# EAGLE schematic tapecleaner (EAGLE 7.2.0)

## Sheet 1 of 2
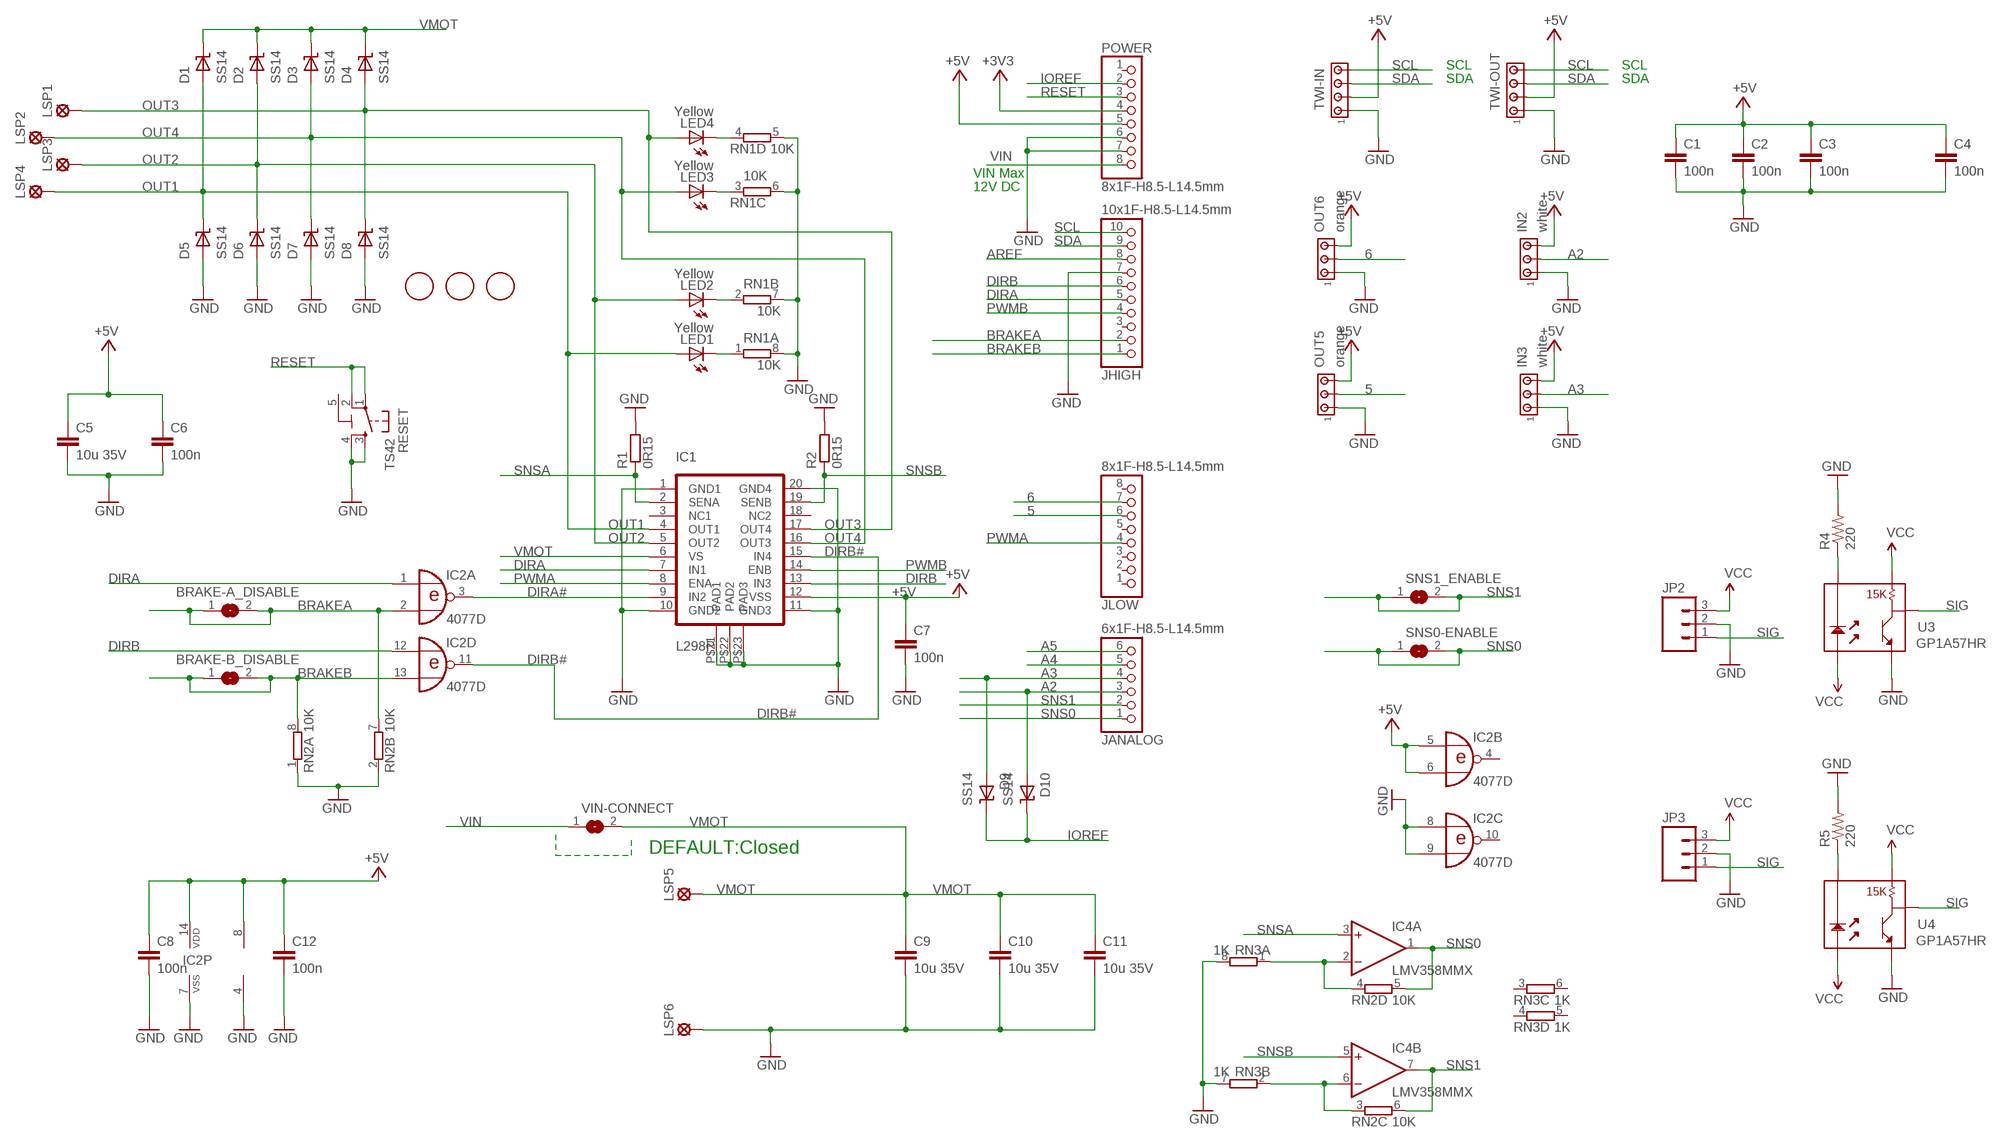
[diagram p0: schematic, sheet 1]

### Parts
BRAKE-A_DISABLE  SJ  [SJ]
BRAKE-B_DISABLE  SJ  [SJ]
C1  100n  C-EUC0603  [C0603-ROUND]
C2  100n  C-EUC0603  [C0603-ROUND]
C3  100n  C-EUC0603  [C0603-ROUND]
C4  100n  C-EUC0603  [C0603-ROUND]
C5  10u 35V  C-EUC1210  [C1210]
C6  100n  C-EUC0603  [C0603-ROUND]
C7  100n  C-EUC0603  [C0603-ROUND]
C8  100n  C-EUC0603  [C0603-ROUND]
C9  10u 35V  C-EUC1210  [C1210]
C10  10u 35V  C-EUC1210  [C1210]
C11  10u 35V  C-EUC1210  [C1210]
C12  100n  C-EUC0603  [C0603-ROUND]
D1  SS14  [SMA]
D2  SS14  [SMA]
D3  SS14  [SMA]
D4  SS14  [SMA]
D5  SS14  [SMA]
D6  SS14  [SMA]
D7  SS14  [SMA]
D8  SS14  [SMA]
D9  SS14  [SMA]
D10  SS14  [SMA]
FID1  FIDUCIALMOUNT  [FIDUCIA-MOUNT]
FID2  FIDUCIALMOUNT  [FIDUCIA-MOUNT]
FID3  FIDUCIALMOUNT  [FIDUCIA-MOUNT]
IC1  L298P  [POWER-SO20]
IC2  4077D  [SO14]
IC4  LMV358MMX  [MSOP08]
IN2  white  MTA03-100  [10X03MTA]
IN3  white  MTA03-100  [10X03MTA]
JANALOG  6x1F-H8.5-L14.5mm  PINHD-1X6TH  [1X06-TH]
JHIGH  10x1F-H8.5-L14.5mm  PINHD-1X10TH  [1X10-TH]
JLOW  8x1F-H8.5-L14.5mm  PINHD-1X8TH  [1X08-TH]
JP2  M03PTH  [1X03]
JP3  M03PTH  [1X03]
LED1  Yellow  LEDCHIPLED_0805  [CHIPLED_0805]
LED2  Yellow  LEDCHIPLED_0805  [CHIPLED_0805]
LED3  Yellow  LEDCHIPLED_0805  [CHIPLED_0805]
LED4  Yellow  LEDCHIPLED_0805  [CHIPLED_0805]
LSP1  LSP13  [LSP13]
LSP2  LSP13  [LSP13]
LSP3  LSP13  [LSP13]
LSP4  LSP13  [LSP13]
LSP5  LSP13  [LSP13]
LSP6  LSP13  [LSP13]
OUT5  orange  MTA03-100  [10X03MTA]
OUT6  orange  MTA03-100  [10X03MTA]
POWER  8x1F-H8.5-L14.5mm  PINHD-1X8TH  [1X08-TH]
R1  0R15  R-EU_R1206  [R1206]
R2  0R15  R-EU_R1206  [R1206]
R4  220  RESISTORPTH1  [AXIAL-0.3]
R5  220  RESISTORPTH1  [AXIAL-0.3]
RESET  TS42  [TS42]
RN1  10K  4R-NCAY16  [CAY16]
RN2  10K  4R-NCAY16  [CAY16]
RN3  1K  4R-NCAY16  [CAY16]
SNS0-ENABLE  SJ  [SJ]
SNS1_ENABLE  SJ  [SJ]
TWI-IN  MTA04-100  [10X04MTA]
TWI-OUT  MTA04-100  [10X04MTA]
U3  GP1A57HR  [GP1A57HR]
U4  GP1A57HR  [GP1A57HR]
VIN-CONNECT  SJ  [SJ]

### Nets
5: JLOW.6 OUT5.2
6: JLOW.7 OUT6.2
+3V3 [power]: POWER.4
+5V [power]: C1.1 C2.1 C3.1 C4.1 C5.1 C6.1 C7.1 C8.1 C12.1 IC1.P$12(VSS) IC2.5(B:I0) IC2.6(B:I1) IC2.14(P:VDD) IC4.8(P:V+) IN2.3 IN3.3 OUT5.3 OUT6.3 POWER.5 TWI-IN.2 TWI-OUT.2
A2: D10.P$2(A) IN2.2 JANALOG.3
A3: D9.P$2(A) IN3.2 JANALOG.4
A4: JANALOG.5
A5: JANALOG.6
AREF: JHIGH.8
BRAKEA: BRAKE-A_DISABLE.1 BRAKE-A_DISABLE.2 IC2.2(A:I1) JHIGH.2 RN2.7
BRAKEB: BRAKE-B_DISABLE.1 BRAKE-B_DISABLE.2 IC2.13(D:I1) JHIGH.1 RN2.8
DIRA: IC1.P$7(IN1) IC2.1(A:I0) JHIGH.5
DIRA#: IC1.P$9(IN2) IC2.3(A:O)
DIRB: IC1.P$13(IN3) IC2.12(D:I0) JHIGH.6
DIRB#: IC1.P$15(IN4) IC2.11(D:O)
GND [power]: C1.2 C2.2 C3.2 C4.2 C5.2 C6.2 C7.2 C8.2 C9.2 C10.2 C11.2 C12.2 D5.P$2(A) D6.P$2(A) D7.P$2(A) D8.P$2(A) IC1.P$1(GND1) IC1.P$10(GND2) IC1.P$11(GND3) IC1.P$20(GND4) IC1.P$21(PAD1) IC1.P$22(PAD2) IC1.P$23(PAD3) IC2.7(P:VSS) IC2.8(C:I0) IC2.9(C:I1) IC4.4(P:V-) IN2.1 IN3.1 JHIGH.7 JP2.2 JP3.2 LSP6.MP OUT5.1 OUT6.1 POWER.6 POWER.7 R1.2 R2.2 R4.P$2 R5.P$2 RESET.3 RESET.4 RN1.5 RN1.6 RN1.7 RN1.8 RN2.1 RN2.2 RN3.7 RN3.8 TWI-IN.1 TWI-OUT.1 U3.5 U4.5 ; also sheet 2
IOREF: D9.P$1(K) D10.P$1(K) POWER.2
N$1: LED4.C RN1.4
N$2: LED3.C RN1.3
N$3: LED2.C RN1.2
N$4: LED1.C RN1.1
N$5: IC4.2(A:-IN) RN2.4 RN3.1
N$7: IC4.6(B:-IN) RN2.3 RN3.2
N$9: R4.P$1 U3.2
N$10: R5.P$1 U4.2
OUT1: D1.P$2(A) D5.P$1(K) IC1.P$4(OUT1) LED1.A LSP4.MP
OUT2: D2.P$2(A) D6.P$1(K) IC1.P$5(OUT2) LED2.A LSP3.MP
OUT3: D4.P$2(A) D8.P$1(K) IC1.P$17(OUT4) LED4.A LSP1.MP
OUT4: D3.P$2(A) D7.P$1(K) IC1.P$16(OUT3) LED3.A LSP2.MP
PWMA: IC1.P$8(ENA) JLOW.4
PWMB: IC1.P$14(ENB) JHIGH.4
RESET: POWER.3 RESET.1 RESET.2
SCL: JHIGH.10 TWI-IN.4 TWI-OUT.4
SDA: JHIGH.9 TWI-IN.3 TWI-OUT.3
SIG: JP2.1 JP3.1 U3.4 U4.4 ; also sheet 2
SNS0: IC4.1(A:OUT) JANALOG.1 RN2.5 SNS0-ENABLE.1 SNS0-ENABLE.2
SNS1: IC4.7(B:OUT) JANALOG.2 RN2.6 SNS1_ENABLE.1 SNS1_ENABLE.2
SNSA: IC1.P$2(SENA) IC4.3(A:+IN) R1.1
SNSB: IC1.P$19(SENB) IC4.5(B:+IN) R2.1
VCC: JP2.3 JP3.3 U3.1 U3.3 U4.1 U4.3 ; also sheet 2
VIN [VIN]: POWER.8 VIN-CONNECT.1
VMOT: C9.1 C10.1 C11.1 D1.P$1(K) D2.P$1(K) D3.P$1(K) D4.P$1(K) IC1.P$6(VS) LSP5.MP VIN-CONNECT.2
Unconnected: IC1.P$3(NC1) IC1.P$18(NC2) IC2.4(B:O) IC2.10(C:O) JHIGH.3 JLOW.1 JLOW.2 JLOW.3 JLOW.5 JLOW.8 POWER.1 RN3.3 RN3.4 RN3.5 RN3.6

### Notes on the sheet
- SCL | SCL
- SDA | SDA
- VIN Max
- 12V DC
- DEFAULT:Closed

## Sheet 2 of 2
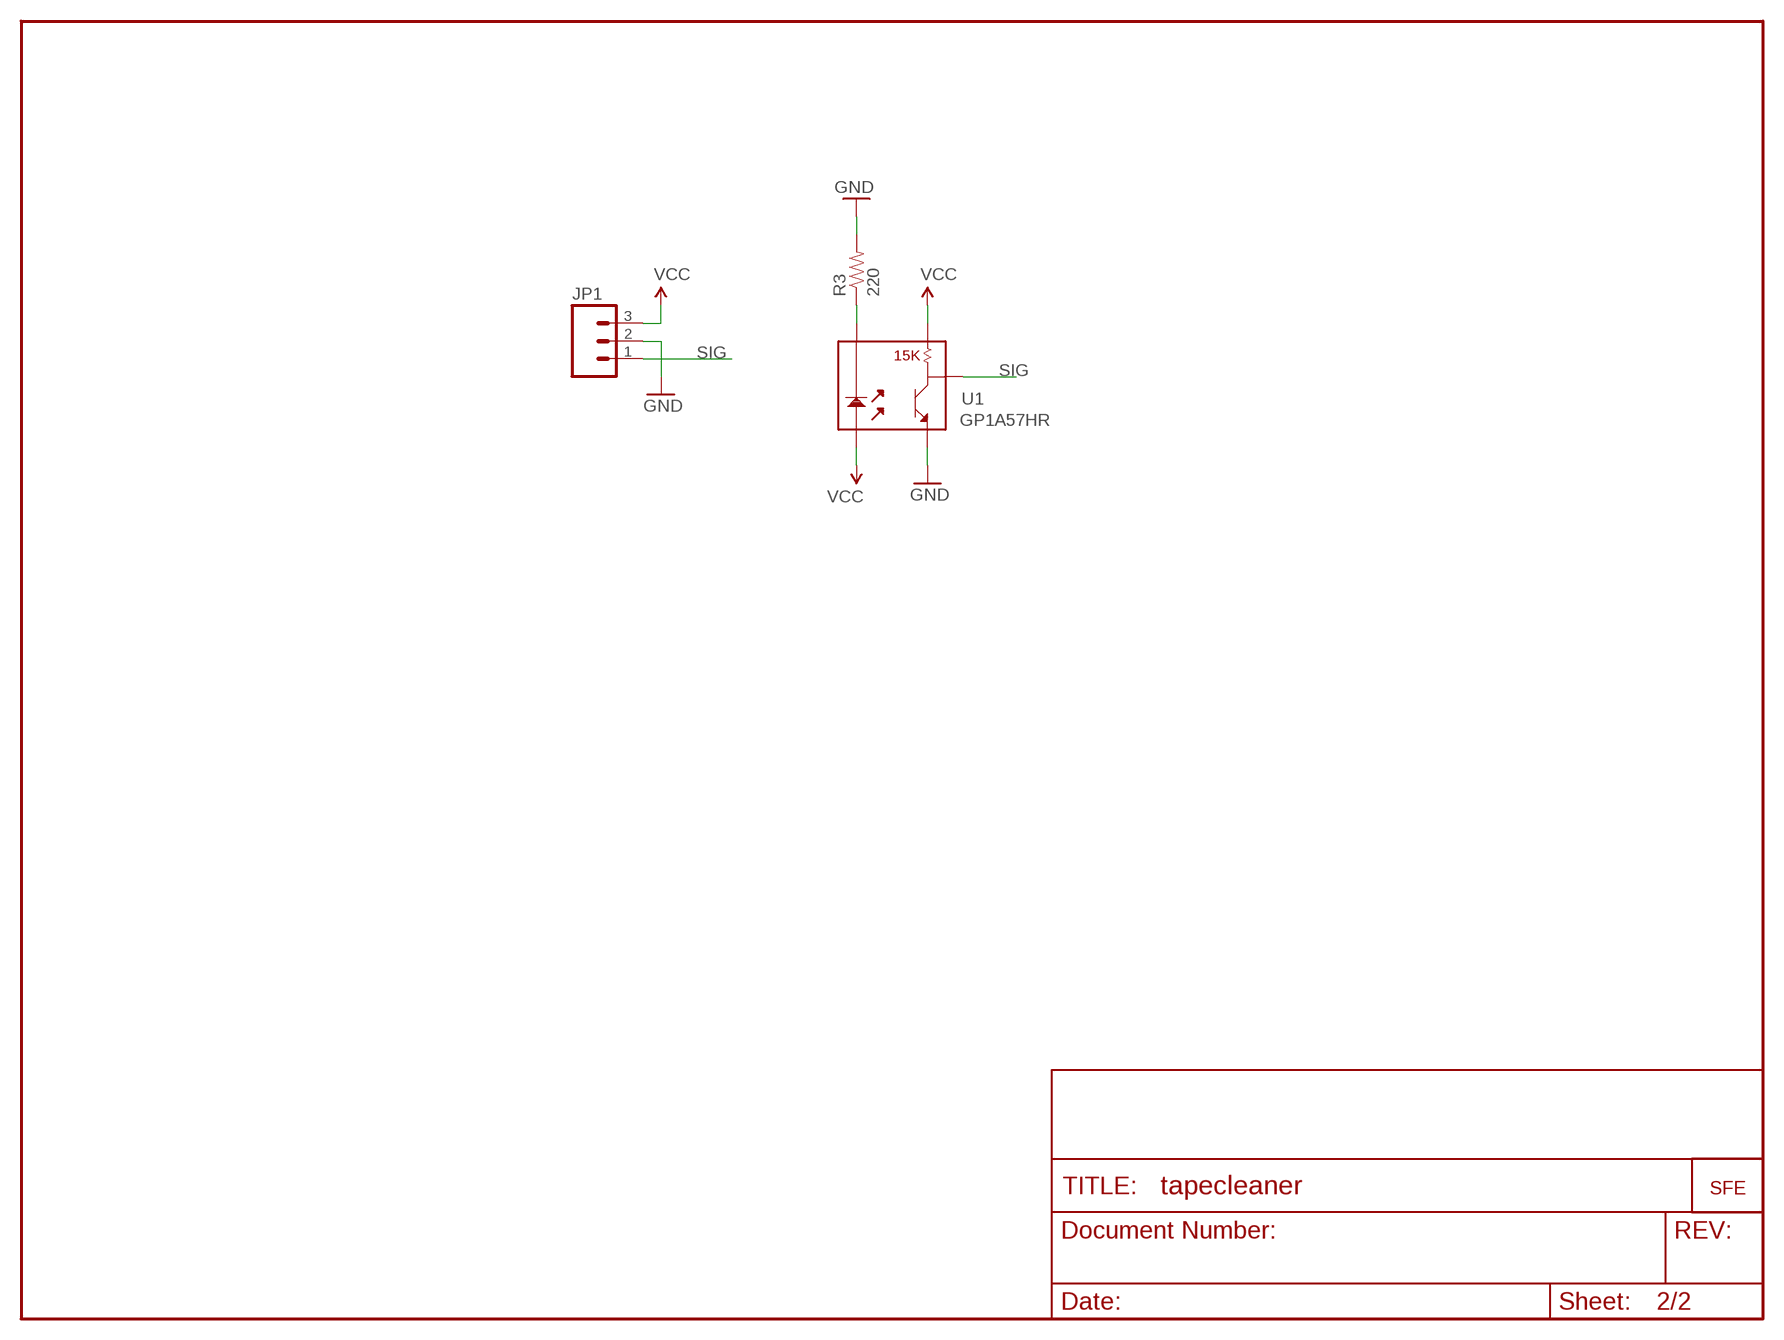
[diagram p1: schematic, sheet 2]

### Parts
JP1  M03PTH  [1X03]
R3  220  RESISTORPTH1  [AXIAL-0.3]
U1  GP1A57HR  [GP1A57HR]
U2  LOGO-SFESK  [SFE-LOGO-FLAME]

### Nets
GND [power]: JP1.2 R3.P$2 U1.5 ; also sheet 1
N$8: R3.P$1 U1.2
SIG: JP1.1 U1.4 ; also sheet 1
VCC: JP1.3 U1.1 U1.3 ; also sheet 1

## Power pins joined to a net without a drawn wire
5-GND: RESET.5(5-GND)

## Library data of the parts
BRAKE-A_DISABLE BRAKE-B_DISABLE SNS0-ENABLE SNS1_ENABLE VIN-CONNECT = jumper:SJ: SMD solder JUMPER
C1-C12 = SmartPrj:C-EU: CAPACITOR, European symbol
D1-D10 = SmartPrj:SS14: DIODE SS14 Diode Schottky 1A 40v
FID1-FID3 = SmartPrj:FIDUCIALMOUNT
IC1 = SmartPrj:L298P: L298P DUAL FUL-BRIDGE DRIVER PowerSO20
IC2 = 40xx:4077: Quad XNOR
IC4 = linear:LMV358?*: Dual General Purpose, Low Voltage, Rail-to-Rail Output Operational Amplifiers Source: http://www.national.com/mpf/LM/LMV321.html http://www.national.com/dt/lmv_qual.pdf
IN2 IN3 OUT5 OUT6 = SmartPrj:MTA03-100: PIN HEADER; OC_FARNELL: unknown; OC_NEWARK: unknown
JANALOG = SmartPrj:PINHD-1X6: PIN HEADER
JHIGH = SmartPrj:PINHD-1X10: PIN HEADER
JLOW POWER = SmartPrj:PINHD-1X8: PIN HEADER
JP1-JP3 = SparkFun:M03: Header 3 Standard 3-pin 0.1" header. Use with straight break away headers (SKU : PRT-00116), right angle break away headers (PRT-00553), swiss pins (PRT-00743), machine pins (PRT-00117), and female headers (PRT-00115). Molex polarized connector foot print use with SKU : PRT-08232 with associated crimp pins and housings.
LED1-LED4 = led:LED: LED OSRAM: - CHIPLED LG R971, LG N971, LY N971, LG Q971, LY Q971, LO R971, LY R971 LH N974, LH R974 LS Q976, LO Q976, LY Q976 LO Q996 - Hyper CHIPLED LW Q18S LB Q993, LB Q99A, LB R99A - SideLED LS A670, LO A670, LY A670, LG A670, LP A670 LB A673, LV A673, LT A673, LW A673 LH A674 LY A675 LS A676, LA A676, LO A676, LY A676, LW A676 LS A679, LY A679, LG A679 - Hyper Micro SIDELED® LS Y876, LA Y876, LO Y876, LY Y876 LT Y87S - SmartLED LW L88C, LW L88S LB L89C, LB L89S, LG L890 LS L89K, LO L89K, LY L89K LS L896, LA L896, LO L896, LY L896 - TOPLED LS T670, LO T670, LY T670, LG T670, LP T670 LSG T670, LSP T670, LSY T670, LOP T670, LYG T670 LG T671, LOG T671, LSG T671 LB T673, LV T673, LT T673, LW T673 LH T674 LS T676, LA T676, LO T676, LY T676, LB T676, LH T676, LSB T676, LW T676 LB T67C, LV T67C, LT T67C, LS T67K, LO T67K, LY T67K, LW E67C LS E67B, LA E67B, LO E67B, LY E67B, LB E67C, LV E67C, LT E67C LW T67C LS T679, LY T679, LG T679 LS T770, LO T770, LY T770, LG T770, LP T770 LB T773, LV T773, LT T773, LW T773 LH T774 LS E675, LA E675, LY E675, LS T675 LS T776, LA T776, LO T776, LY T776, LB T776 LHGB T686 LT T68C, LB T68C - Hyper Mini TOPLED® LB M676 - Mini TOPLED Santana® LG M470 LS M47K, LO M47K, LY M47K Source: http://www.osram.convergy.de LUXEON: - LUMILED® LXK2-PW12-R00, LXK2-PW12-S00, LXK2-PW14-U00, LXK2-PW14-V00 LXK2-PM12-R00, LXK2-PM12-S00, LXK2-PM14-U00 LXK2-PE12-Q00, LXK2-PE12-R00, LXK2-PE12-S00, LXK2-PE14-T00, LXK2-PE14-U00 LXK2-PB12-K00, LXK2-PB12-L00, LXK2-PB12-M00, LXK2-PB14-N00, LXK2-PB14-P00, LXK2-PB14-Q00 LXK2-PR12-L00, LXK2-PR12-M00, LXK2-PR14-Q00, LXK2-PR14-R00 LXK2-PD12-Q00, LXK2-PD12-R00, LXK2-PD12-S00 LXK2-PH12-R00, LXK2-PH12-S00 LXK2-PL12-P00, LXK2-PL12-Q00, LXK2-PL12-R00 Source: www.luxeon.com KINGBRIGHT: KA-3528ASYC Source: www.kingbright.com
LSP1-LSP6 = solpad:LSP13: SOLDER PAD drill 1.3 mm, distributor Buerklin, 12H562
R1 R2 = SmartPrj:R-EU_: RESISTOR, European symbol
R3-R5 = SparkFun:RESISTOR: Resistor Basic schematic elements and footprints for 0603, 1206, and PTH 1/10th watt (small) resistors.
RESET = SmartPrj:TS42: TS42 Dongnan Electronics Tact switch VDC 12V - 50mA
RN1-RN3 = resistor-dil:4R-N: Array Chip Resistor Source: RS Component / Phycomp
TWI-IN TWI-OUT = con-amp:MTA04-100: AMP connector
U1 U3 U4 = SparkFun:GP1A57HR
U2 = SparkFun:LOGO-SFE: Spark Fun Electronics PCB Logo This is the standard Spark Fun Electronics PCB logo.

## Net classes
1 power: width 0.406 mm, drill 0.61 mm, clearance 0.152 mm
2 VIN: width 0.406 mm, drill 0.61 mm, clearance 0.152 mm